# Altium schematic sheet power supply.SchDoc
size A3
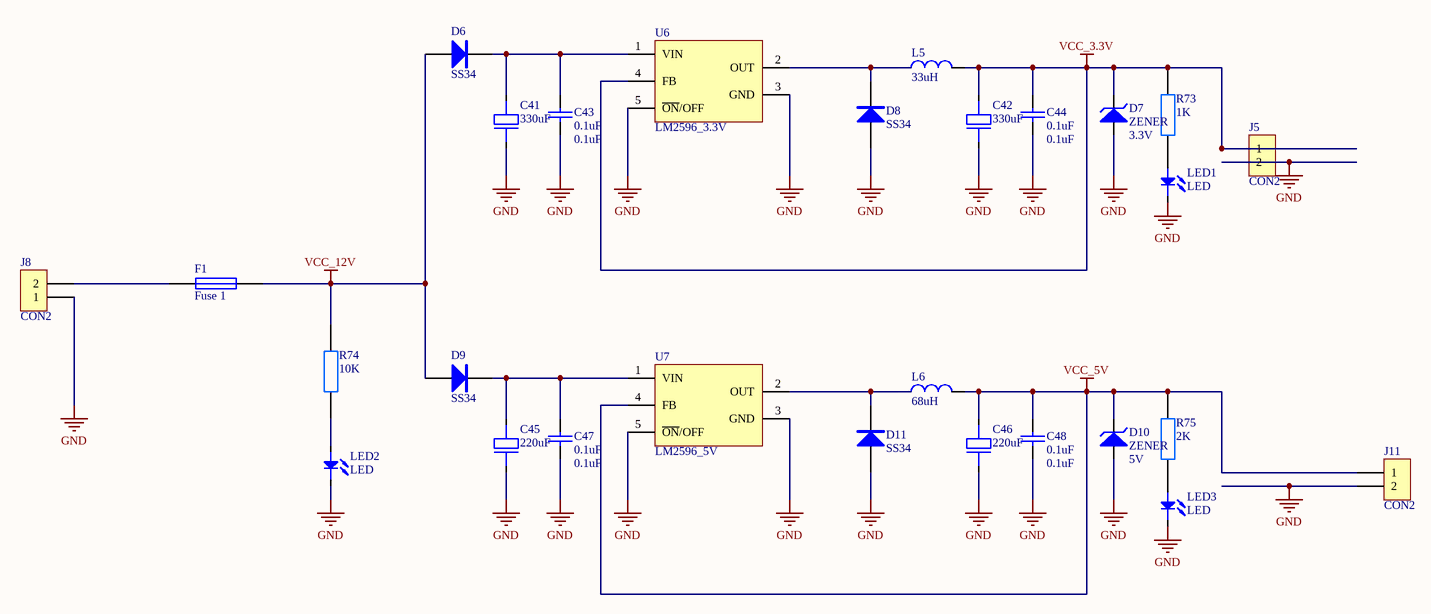
[diagram p0: power supply.SchDoc]

## Parts
C41  330uF  [RVT 220uF]
C42  330uF  [RVT 220uF]
C43  0.1uF  [0805 CAP]
C44  0.1uF  [0805 CAP]
C45  220uF  [RVT 220uF]
C46  220uF  [RVT 220uF]
C47  0.1uF  [0805 CAP]
C48  0.1uF  [0805 CAP]
D6  SS34  [DO-241AC]
D7  ZENER  value 3.3V  [1206 DIODE]
D8  SS34  [DO-241AC]
D9  SS34  [DO-241AC]
D10  ZENER  value 5V  [1206 DIODE]
D11  SS34  [DO-241AC]
F1  Fuse 1  [FUSE1]
J5  CON2  [DG1282]
J8  CON2  [con2]
J11  CON2  [DG1282]
L5  33uH  [12x12]
L6  68uH  [12x12]
LED1  LED  [3528 led]
LED2  LED  [3528 LED]
LED3  LED  [3528 led]
R73  1K  [0805]
R74  10K  [0805]
R75  2K  [0805]
U6  LM2596_3.3V  [to-263-5]
U7  LM2596_5V  [to-263-5]

## Nets
GND: C41.2 C42.2 C43.2 C44.2 C45.2 C46.2 C47.2 C48.2 D7.1(A) D8.1(A) D10.1(A) D11.1(A) J5.2 J8.1 J11.2 LED1.2 LED2.2 LED3.2 U6.3(GND) U6.5(~{ON}/OFF) U7.3(GND) U7.5(~{ON}/OFF)
VCC_3.3V: C42.1 C44.1 D7.2(K) J5.1 L5.1 R73.2 U6.4(FB)
VCC_5V: C46.1 C48.1 D10.2(K) J11.1 L6.1 R75.2 U7.4(FB)
VCC_12V: D6.1(A) D9.1(A) F1.2 R74.2
NetC41_1: C41.1 C43.1 D6.2(K) U6.1(VIN)
NetC45_1: C45.1 C47.1 D9.2(K) U7.1(VIN)
NetD8_2: D8.2(K) L5.2 U6.2(OUT)
NetD11_2: D11.2(K) L6.2 U7.2(OUT)
NetF1_1: F1.1 J8.2
NetLED1_1: LED1.1 R73.1
NetLED2_1: LED2.1 R74.1
NetLED3_1: LED3.1 R75.1

## Library data of the parts
C41 C42 C45 C46 = Electrolytic CAP
  C41 C42: VALUE: 330uF
  C45 C46: VALUE: 220uF
C43 C44 C47 C48 = CAP: VALUE: 0.1uF
D6 D8 D9 D11 = SS14: Diode
F1 = Fuse 1: Fuse; Published: 8-Jun-2000; LatestRevisionDate: 17-Jul-2002; LatestRevisionNote: Re-released for DXP Platform.; PackageReference: PIN-W2/E2.8; Publisher: Altium Limited; PackageDescription: Thru-Hole; 2 Leads
L5 L6 = Inductance
  L5: value: 33uH
  L6: value: 68uH
R73-R75 = RES
  R73: VALUE: 1K
  R74: VALUE: 10K
  R75: VALUE: 2K
U6 U7 = LM2596: IC-power